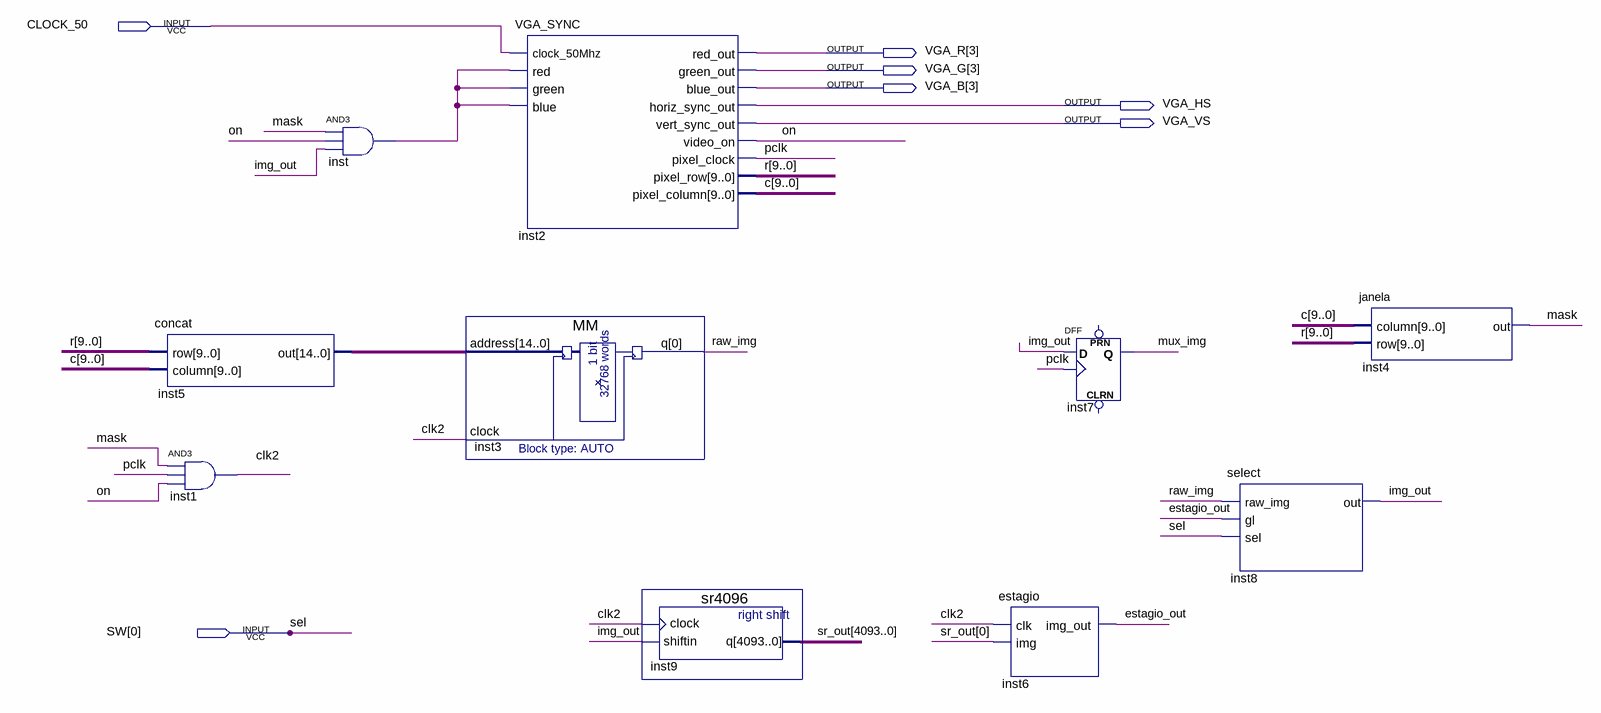
[diagram p0: schematic sheet]
// Quartus schematic lab3.bdf as structural Verilog: 10 symbols, 7 pins
module lab3 (
  input  CLOCK_50,
  input  [0:0] SW,
  output [3:3] VGA_R,
  output [3:3] VGA_G,
  output [3:3] VGA_B,
  output VGA_HS,
  output VGA_VS
);

  wire clk2, estagio_out, img_out, inst_out, mask, mux_img, on, pclk, raw_img;
  wire [9:0] c, r;
  wire [14:0] inst5_out;
  wire [4093:0] sr_out;

  concat inst5 (.row(r), .column(c), .out(inst5_out));
  and inst1 (clk2, mask, pclk, on);
  and inst (inst_out, mask, on, img_out);
  MM inst3 (.address(inst5_out), .clock(clk2), .q(raw_img));
  VGA_SYNC inst2 (
    .clock_50Mhz(CLOCK_50), .red(inst_out), .green(inst_out), .blue(inst_out), .red_out(VGA_R[3]),
    .green_out(VGA_G[3]), .blue_out(VGA_B[3]), .horiz_sync_out(VGA_HS), .vert_sync_out(VGA_VS),
    .video_on(on), .pixel_clock(pclk), .pixel_row(r), .pixel_column(c));
  sr4096 inst9 (.clock(clk2), .shiftin(img_out), .q(sr_out));
  estagio inst6 (.clk(clk2), .img(sr_out[0]), .img_out(estagio_out));
  DFF inst7 (.CLK(pclk), .D(img_out), .Q(mux_img));  // open: CLRN, PRN
  select inst8 (.raw_img(raw_img), .gl(estagio_out), .sel(SW[0]), .out(img_out));
  janela inst4 (.column(c), .row(r), .out(mask));

  // Other names for the same wires on the sheet: sel = SW[0]
endmodule
